# EAGLE design mainboard.pa5 (EAGLE 4.11)
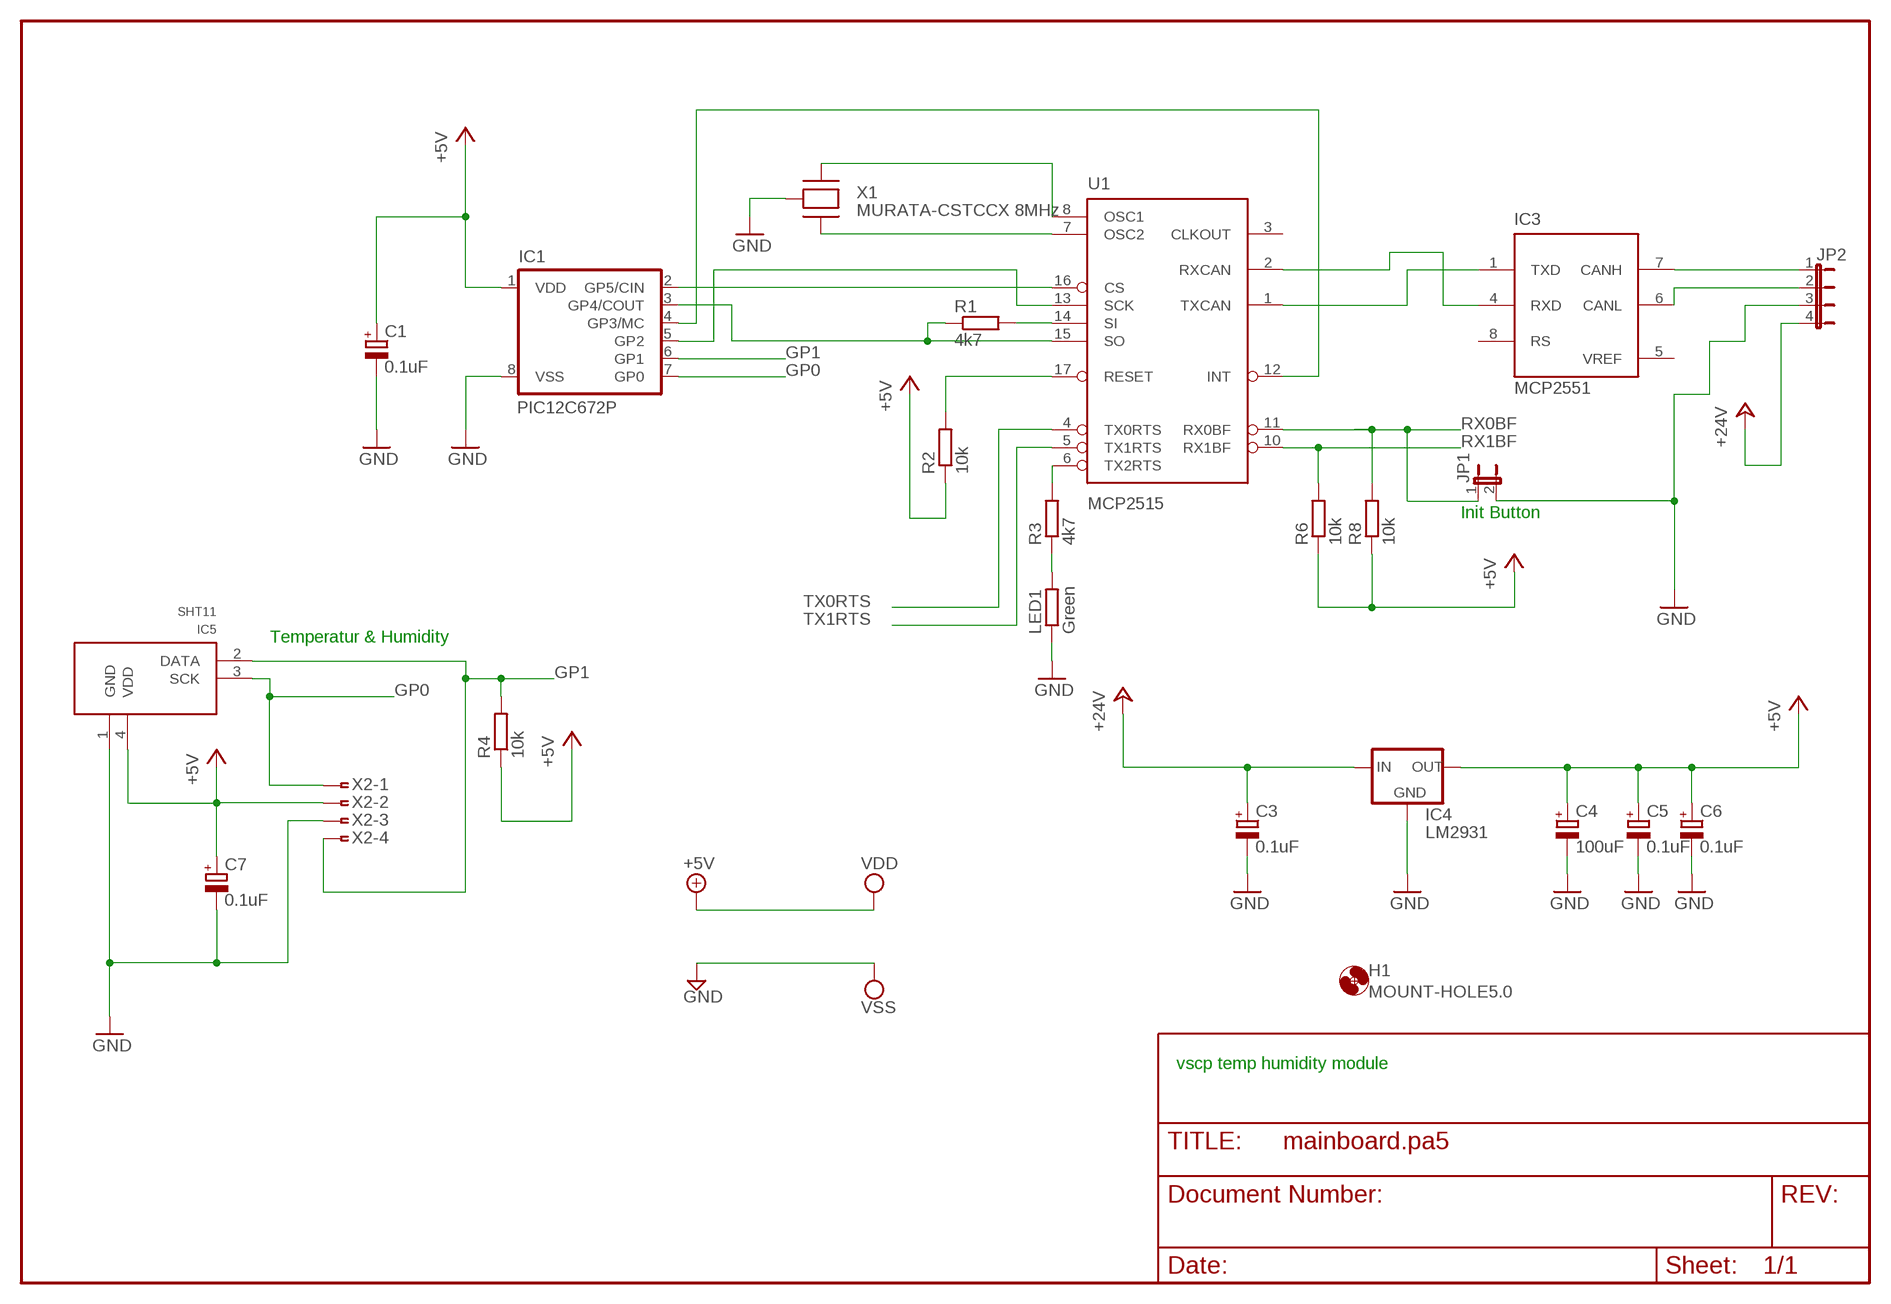
[diagram p0: schematic, sheet 1]

## Parts
C1  0.1uF  CPOL-EUCT3216  [CT3216]
C3  0.1uF  CPOL-EUCT3216  [CT3216]
C4  100uF  CPOL-EUCT7343  [CT7343]
C5  0.1uF  CPOL-EUCT3216  [CT3216]
C6  0.1uF  CPOL-EUCT3216  [CT3216]
C7  0.1uF  CPOL-EUCT3216  [CT3216]
H1  MOUNT-HOLE5.0  [5,0]
IC1  PIC12C672P  [DIL8]
IC3  MCP2551  MCP2551SN  [SO-08]
IC4  LM2931  78LXX  [78LXX]
IC5  SHT11  SHT1X  [SHT1X]
JP1  JP1E  [JP1]
JP2  JP4E  [JP4]
LED1  Green  R-EU_R1206  [R1206]
R1  4k7  R-EU_R0805  [R0805]
R2  10k  R-EU_R0805  [R0805]
R3  4k7  R-EU_R0805  [R0805]
R4  10k  R-EU_R0805  [R0805]
R6  10k  R-EU_R0805  [R0805]
R8  10k  R-EU_R0805  [R0805]
U1  MCP2515  MCP2510SO  [SO-18W]
X1  MURATA-CSTCCX 8MHz  MURATA-CSTCCX  [RESONATOR-MURATA-CSTCCX]
X2  FTOP-4  [FTOP-4]

## Nets
+5V: C1.+ C4.+ C5.+ C6.+ C7.+ IC1.1(VDD) IC4.OUT IC5.4(VDD) R2.1 R4.1 R6.1 R8.1 X2.2
+24V: C3.+ IC4.IN JP2.4
CANH: IC3.7(CANH) JP2.1
CANL: IC3.6(CANL) JP2.2
GND: C1.- C3.- C4.- C5.- C6.- C7.- IC1.8(VSS) IC4.GND IC5.1(GND) JP1.2 JP2.3 LED1.1 X1.3(GND) X2.3
GP0: IC1.7(GP0) IC5.3(SCK) X2.1
GP1: IC1.6(GP1) IC5.2(DATA) R4.2 X2.4
GP2: IC1.5(GP2) U1.13(SCK)
GP3: IC1.4(GP3/MC) U1.12(INT)
GP4: IC1.3(GP4/COUT) R1.1 U1.15(SO)
GP5: IC1.2(GP5/CIN) U1.16(CS)
N$3: R2.2 U1.17(RESET)
N$7: R1.2 U1.14(SI)
N$10: LED1.2 R3.1
OSC1: U1.8(OSC1) X1.2(XTIN)
OSC2: U1.7(OSC2) X1.1(XTOUT)
RX0BF: JP1.1 R8.2 U1.11(RX0BF)
RX1BF: R6.2 U1.10(RX1BF)
RXCAN: IC3.4(RXD) U1.2(RXCAN)
TX0RTS: U1.4(TX0RTS)
TX1RTS: U1.5(TX1RTS)
TX2RTS: R3.2 U1.6(TX2RTS)
TXCAN: IC3.1(TXD) U1.1(TXCAN)
Unconnected: IC3.8(RS) U1.3(CLKOUT)

## Notes on the sheet
- Init Button
- Temperatur & Humidity
- vscp temp humidity module

## Power pins joined to a net without a drawn wire
VDD: IC3.3(VDD) U1.18(VDD)
VREF: IC3.5(VREF)
VSS: IC3.2(VSS) U1.9(VSS)

## Library data of the parts
C1 C3-C7 = rcl:CPOL-EU: POLARIZED CAPACITOR, European symbol
H1 = holes:MOUNT-HOLE: MOUNTING HOLE with drill center marker
IC1 = microchip:PIC12C*?: MICROCONTROLLER
IC3 = microchip_can:MCP2551: High Speed CAN tranceiver
IC4 = v-reg:78LXX: VOLTAGE REGULATOR
IC5 = eurosource_ftdi:SHT1X
JP1 = jumper:JP1E: JUMPER
JP2 = jumper:JP4E: JUMPER
LED1 R1-R4 R6 R8 = rcl:R-EU_: RESISTOR, European symbol
U1 = microchip_can:MCP2510
X1 = eurosource_ftdi:MURATA-CSTCCX
X2 = con-amp:FTOP-4: AMP connector

## Board
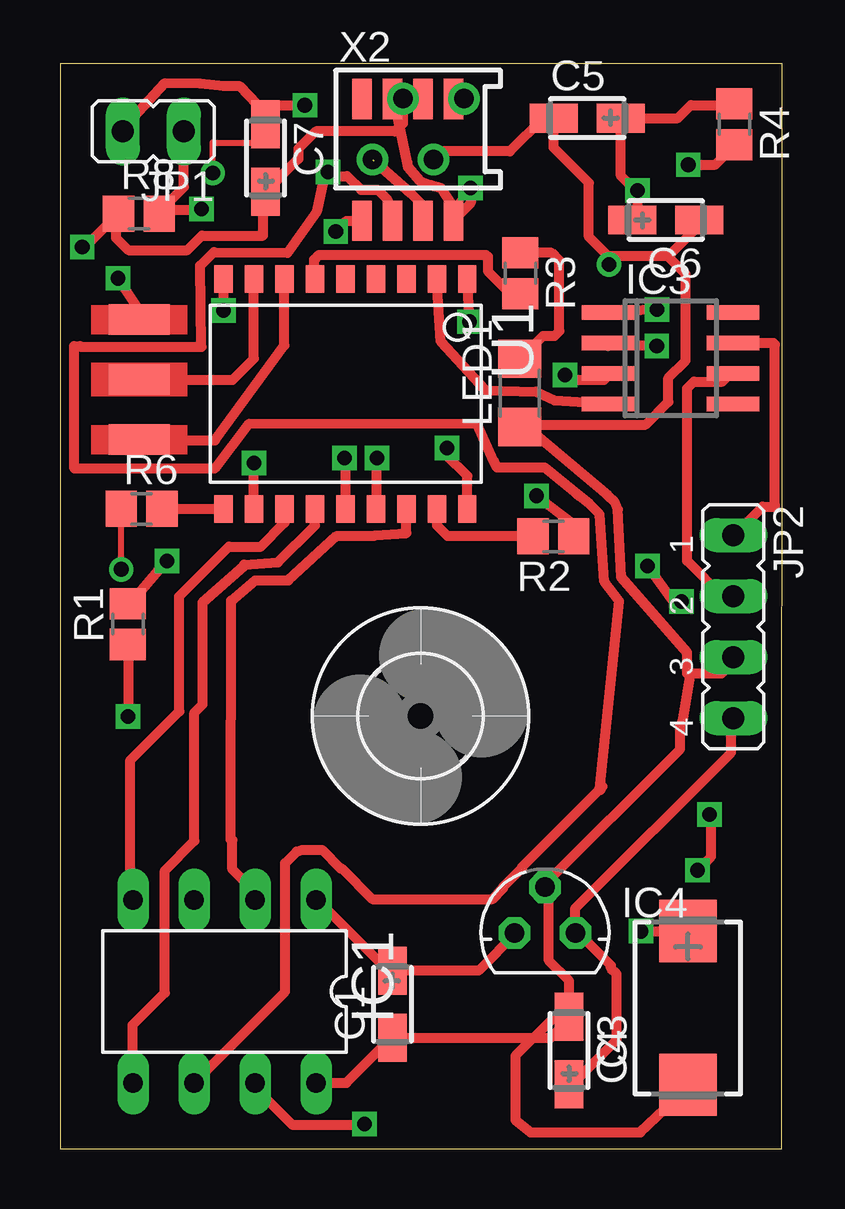
[diagram p1: board, top side]
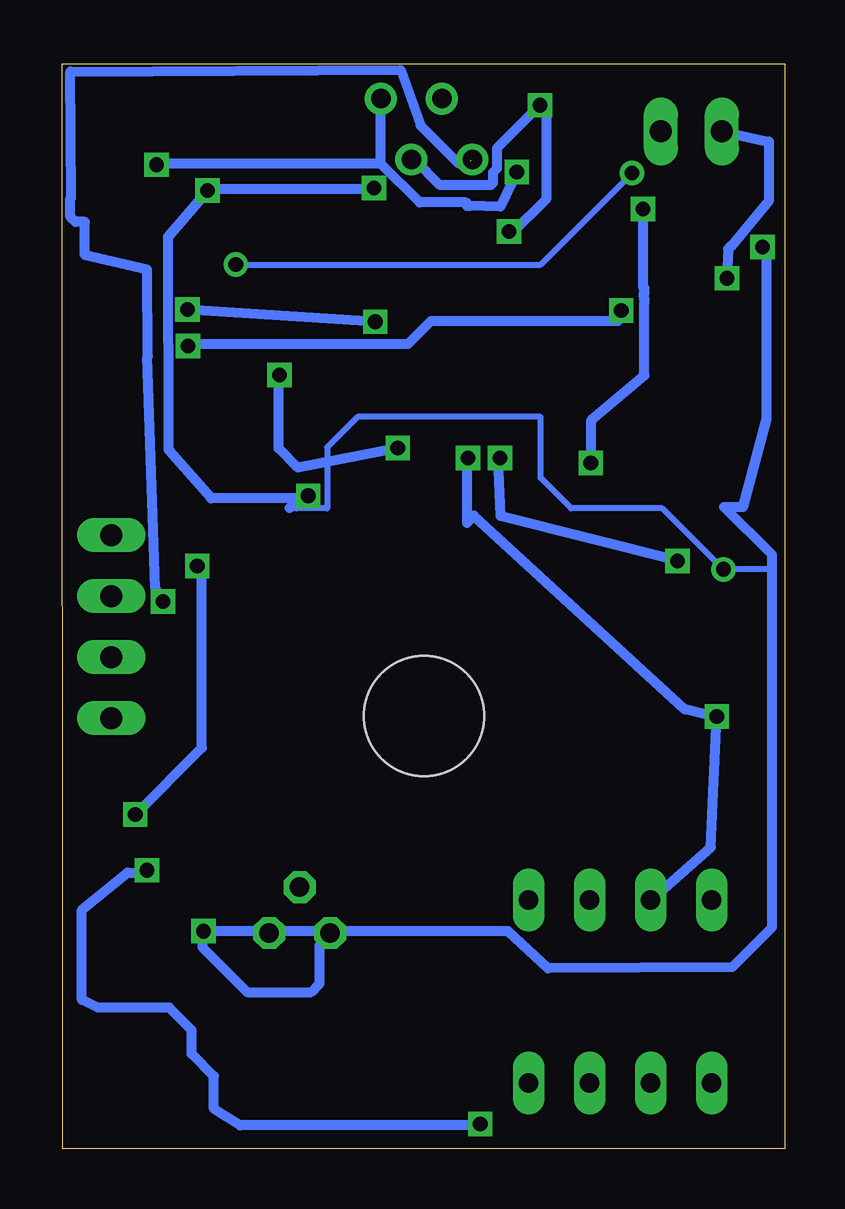
[diagram p2: board, bottom side, seen from below]

Size 30.1 x 45.21 mm. Coordinates in mm from the lower left corner, seen from the top.
Outline: 0.01,0 30.08,0 30.1,45.21 0,45.2 0.01,0
Copper layers (1*16): Top 0.0254mm / dielectric 1.4986mm / Bottom 0.0254mm
Design rules "default": minimum track width 10mil, minimum drill 24mil, track to track 8mil, track to pad 8mil, pad to pad 8mil, via to via 8mil, smd to smd 8mil, copper to edge 40mil, drill to drill 8mil, minimum pad ring 10mil, minimum via ring 8mil, stop-mask expansion 4mil, vias tented up to drill 0mil, thermal gap 10mil

### Footprints (pad centres in the part's own frame; a part is rotated, then mirrored left to right if it is on the bottom)
CT3216 = smd 2 x 1.2: + 1.4,0; - -1.4,0
CT7343 = smd 2.6 x 2.4: + 3.2,0; - -3.2,0
5,0 = hole 5: 0,0
DIL8 = drill 0.813 long: 1 -3.81,-3.81; 2 -1.27,-3.81; 3 1.27,-3.81; 4 3.81,-3.81; 5 3.81,3.81; 6 1.27,3.81; 7 -1.27,3.81; 8 -3.81,3.81
SO-08 = smd 0.6 x 2.2: 1 -1.905,-2.6; 2 -0.635,-2.6; 3 0.635,-2.6; 4 1.905,-2.6; 5 1.905,2.6; 6 0.635,2.6; 7 -0.635,2.6; 8 -1.905,2.6
78LXX = drill 0.813 octagon: GND 0,1.905; IN 1.27,0; OUT -1.27,0
SHT1X = smd 1.676 x 0.813: 1 -2.54,2.54; 2 -2.54,1.27; 3 -2.54,0; 4 -2.54,-1.27; P$5 2.54,2.54; P$6 2.54,1.27; P$7 2.54,0; P$8 2.54,-1.27
JP1 = drill 0.914 long: 1 0,-1.27; 2 0,1.27
JP4 = drill 0.914 long: 1 -3.81,0; 2 -1.27,0; 3 1.27,0; 4 3.81,0
R1206 = smd 1.6 x 1.803: 1 -1.422,0; 2 1.422,0
R0805 = smd 1.3 x 1.5: 1 -0.85,0; 2 0.85,0
SO-18W = smd 0.762 x 1.143: 1 -5.08,-4.788; 2 -3.81,-4.788; 3 -2.54,-4.788; 4 -1.27,-4.788; 5 0,-4.788; 6 1.27,-4.788; 7 2.54,-4.788; 8 3.81,-4.788; 9 5.08,-4.788; 10 5.08,4.788; 11 3.81,4.788; 12 2.54,4.788; 13 1.27,4.788; 14 0,4.788; 15 -1.27,4.788; 16 -2.54,4.788; 17 -3.81,4.788; 18 -5.08,4.788
RESONATOR-MURATA-CSTCCX = smd 2.54 x 1.27: 1 0,2.4; 2 0,-0.1; 3 0,-2.6
FTOP-4 = drill 0.813 round: 1 -1.905,-1.27; 2 -0.635,1.27; 3 0.635,-1.27; 4 1.905,1.27

### Placement (x,y rotation side)
C1  13.85,6.01 90 top
C3  21.21,4.09 270 top
C4  26.16,5.86 90 top
C5  21.97,42.93 0 top
C6  25.24,38.69 180 top
C7  8.56,41.28 270 top
H1  15.02,18.02 0 top
IC1  6.86,6.54 180 top
IC3  25.45,32.93 270 top
IC4  20.21,8.98 0 top
IC5  15.13,41.19 90 top
JP1  3.89,42.38 90 top
JP2  28.06,21.74 270 top
LED1  19.15,31.49 90 top
R1  2.83,21.85 90 top
R2  20.56,25.51 180 top
R3  19.18,36.47 270 top
R4  28.1,42.68 270 top
R6  3.4,26.66 0 top
R8  3.29,38.95 0 top
U1  11.89,31.44 180 top
X1  3.31,31.94 180 top
X2  14.92,42.48 0 top

### Tracks (layer width: path | path; a pad name or v marks a point on that pad's centre or on a via)
+5V  (via drill 0.61)
  Top 0.254: 16.52,39.37 IC5.4 | v17.11,40.02 16.52,39.37 | 16.52,39.37 16.39,39.25 | v2.55,24.13 2.55,26.67 R6.1
  Top 0.406: IC1.1 10.71,10.35 10.72,10.37 13.68,7.41 C1.+ 17.44,7.41 19.01,8.98 | 19.01,8.98 19.07,9.04 | IC4.OUT 19.01,8.98 | C6.+ 24.06,38.69 v24.06,39.92 24.06,39.84 | v17.11,40.02 17.11,39.4 16.4,38.68 | 8.63,40.3 8.46,40.13 8.46,38.04 8.45,38.03 5.91,38.03 5.31,37.43 2.85,37.43 2.33,37.95 2.33,38.92 2.39,38.98 2.41,38.95 R8.1 1.1,37.62 0.99,37.62 v0.93,37.56 | v24.21,9.06 C4.+ | 16.4,39.24 16.39,39.25 15.88,40.02 15.44,40.14 15.01,40.3 14.5,40.88 14.48,41.09 13.93,43.67 14.27,43.69 14.29,43.71 X2.2 14.29,42.71 13.96,42.39 10.67,42.39 9.94,41.66 9.94,41.24 8.58,39.88 C7.+ | R4.1 28.1,43.49 28.1,43.48 26.29,43.48 25.74,42.93 C5.+ 23.37,40.53 24.06,39.84 | v0.93,37.56 | 24.06,39.84 24.1,39.79 | R2.1 21.41,26.02 v19.85,27.2
  Bottom 0.254: 0.53,24.13 v2.55,24.13 5.09,26.67 8.9,26.67 10.17,27.94 10.17,30.48 17.79,30.48 19.06,29.21 19.06,26.67 20.33,26.67 v19.85,27.2
  Bottom 0.406: v17.11,40.02 17.11,39.99 24.07,39.99 24.07,39.92 v24.06,39.92 24.02,39.92 | 23.64,9.06 v24.21,9.06 | 23.64,9.06 24.26,9.14 24.26,8.39 22.4,6.52 19.73,6.52 19.37,6.88 19.37,8.47 18.9,8.95 IC4.OUT | 23.64,9.06 11.52,9.06 9.85,7.5 2.19,7.56 0.53,9.22 0.53,24.13 0.53,24.74 2.53,26.74 1.73,26.74 0.76,30.4 0.76,36.93 | 0.76,36.93 0.7,37.56 v0.93,37.56 | v19.85,27.2 20.64,26.68 20.23,27.09 23.9,27.09 25.66,29.09 25.7,38 24.02,39.92 | 24.02,39.92 23.94,40 | 0.76,36.93 0.76,37.42 0.99,37.65 1.05,37.65 1.21,37.82
+24V
  Top 0.406: C3.+ 21.34,2.69 23.19,4.53 23.19,7.28 22.95,7.51 22.95,7.63 21.56,9.02 21.52,8.98 IC4.IN 21.48,10.01 27.96,16.5 27.96,17.65 28.16,17.85 JP2.4
CANH
  Top 0.406: IC3.7 29.73,33.56 29.79,33.5 29.79,26.79 29.75,26.75 29.27,26.75 28.06,25.53 | 28.06,25.53 27.96,25.44 | JP2.1 28.06,25.53
CANL
  Top 0.406: JP2.2 27.6,23.01 26.13,24.48 26.13,31.67 26.41,31.95 27.6,31.95 27.96,32.31 27.98,32.29 IC3.6
GND  (via drill 0.61)
  Top 0.254: JP2.3 27.95,20.32 27.56,19.79 | 8.56,43.11 8.9,43.18 C7.- 8.9,41.91 6.36,41.91 v6.36,40.64 | 22.87,37.18 v22.87,36.83
  Top 0.406: C6.- 26.75,38.58 25.34,37.18 25.34,37.15 | X2.3 15.56,41.18 15.97,41.54 18.75,41.54 20.14,42.93 C5.- 20.57,41.7 22.03,40.23 22.03,37.98 22.84,37.18 22.87,37.18 25.32,37.18 | 8.56,43.11 7.5,44.26 6.81,44.26 5.84,44.38 4.36,44.38 2.64,42.48 JP1.2 | 13.85,4.66 13.93,4.73 | 13.85,4.66 C1.- 20.45,4.61 21.28,5.45 21.24,5.49 C3.- | IC1.8 11.93,2.73 13.85,4.66 | C3.- 20.61,5.49 18.98,3.86 18.98,1.2 19.61,0.68 24.18,0.68 26.21,2.59 26.16,2.64 C4.- | C3.- 21.21,6.99 20.37,7.83 20.37,10.89 20.25,11.01 20.21,10.97 IC4.GND 20.08,10.89 | 26.13,19.79 26.25,19.67 25.97,17.92 25.84,17.58 25.84,16.65 20.08,10.89 | 28.15,20.47 28.2,20.43 27.56,19.79 26.13,19.79 | 26.13,19.79 26.13,20.67 23.38,23.81 23.25,26.63 23.11,26.94 22.84,27.19 19.33,30.16 | 19.33,30.16 LED1.1 | 25.34,37.15 25.46,37.29 | 25.32,37.18 25.34,37.15 | 20.08,10.89 20,10.81 | X1.3 3.46,34.7 v2.41,36.26 | IC5.1 11.94,38.65 v11.49,38.21 | v10.2,43.47 8.91,43.47 8.68,43.24 8.68,42.47 8.56,42.59 C7.- | 19.33,30.16 24.4,30.16 25.35,31.11 25.35,32.11 26.07,32.83 26.07,36.43 25.32,37.18 | 25.32,37.18 25.31,37.19 | 25.32,37.18
  Bottom 0.254: v6.36,40.64 10.17,36.83 v22.87,36.83
  Bottom 0.406: v2.41,36.26 2.36,37.49 2.27,37.58 2.24,37.58 0.66,39.49 0.66,41.95 2.64,42.38 | 2.64,42.38 2.65,42.38 | JP1.2 2.64,42.38 | v11.49,38.21 11.43,38.15 11.35,38.15 9.94,39.55 9.94,43.21 v10.2,43.47 | X2.3 15.42,41.21 14.36,40.15 12.25,40.15 12.16,40.23 12.16,40.66 12,40.83 12,41.67 v10.2,43.47 | v10.2,43.47 10.14,43.52
GP0  (via drill 0.61)  (1 unrouted)
  Top 0.406: 13.02,41.19 13.01,41.18 | 13.02,41.19 X2.1 | 15.13,39.1 IC5.3 15.13,38.7 15.07,38.76 15.07,39.36 14.63,39.79 13.06,41.19 13.02,41.19 | v25.9,22.79 25.9,22.76 25.84,22.69 25.6,22.69 v24.48,24.27 | v27.06,13.91 27.13,13.85 27.13,12.16 v26.56,11.6 | 12.73,0.78 12.63,0.77 v12.68,1.03 12.68,0.99 12.68,0.98 12.67,0.99 9.67,0.99 8.13,2.53 IC1.7
  Bottom 0.406: 13.09,41.14 13.41,41.04 13.58,41.04 15.17,42.63 16,44.95 29.77,44.88 29.73,39.6 29.77,39.56 29.76,38.81 29.75,38.81 29.55,38.61 29.16,38.61 29.16,37.22 26.57,36.62 26.53,33.02 26.56,32.99 26.23,23.36 v25.9,22.79 | v24.48,24.27 24.28,24.05 24.28,16.7 v27.06,13.91 | v26.56,11.6 26.56,11.56 26.5,11.5 27.39,11.5 29.28,9.94 29.28,6.2 28.62,5.87 25.64,5.87 24.71,4.94 24.71,3.95 23.78,3.02 23.78,1.66 22.69,0.97 12.86,0.97 v12.68,1.03
GP1  (via drill 0.61)
  Top 0.406: 13.86,38.63 13.9,38.59 | 13.86,38.63 IC5.2 | 13.86,38.63 13.65,38.84 13.65,39.53 13.24,39.94 12.55,39.94 11.97,40.52 11.36,40.52 11.19,40.68 v11.16,40.68 11.16,40.72 | 0.84,33.41 0.79,33.41 | 0.84,33.41 5.89,33.41 5.84,36.79 6.41,37.36 9.49,37.32 10.72,39.06 11.06,40.61 11.16,40.72 | IC1.6 5.59,2.75 9.38,6.54 9.38,11.89 9.86,12.37 10.11,12.44 10.92,12.44 11.68,11.68 11.73,11.68 13.02,10.39 18.01,10.39 18.46,10.84 18.46,10.89 19.25,11.68 19.25,11.73 22.49,14.97 | 11.16,40.72 11.23,40.78 | R4.2 28.1,41.79 28.11,41.79 27.31,40.99 v26.18,40.99 | 22.49,14.97 22.61,15.09 | 22.49,14.97 | 22.49,14.97 23.3,22.81 22.69,23.62 22.49,26.42 22.08,26.84 21.53,27.28 21.66,27.17 20.19,28.38 18.21,28.38 18.07,28.64 17.38,30.18 7.87,30.2 6.44,28.33 0.6,28.33 0.59,33.43 0.84,33.43 | 22.49,14.97 22.51,14.94 | 0.84,33.43 | 0.84,33.43 0.84,33.41
  Bottom 0.406: 13.14,39.27 11.84,39.24 v11.16,40.68 | 13.14,39.27 13.25,39.28 | 16.83,41.04 X2.4 | 16.83,41.04 15.21,39.42 13.29,39.42 13.14,39.27 | 13.14,39.27 | 13.14,39.27 | 16.83,41.04 26.13,41.04 v26.18,40.99
GP2
  Top 0.406: U1.13 10.62,25.95 9.08,24.42 7.67,24.33 7.67,24.29 7.67,24.28 5.95,22.76 5.95,18.5 5.6,18.16 5.6,12.82 4.37,11.58 4.37,6.48 3.03,5.15 3.03,2.82 3.12,2.73 | 3.12,2.73 3.18,2.68 | IC1.5 3.12,2.73
GP3
  Top 0.406: 3.03,10.22 3.05,10.23 IC1.4 2.92,10.35 2.88,10.39 2.93,10.44 2.93,16.18 4.97,18.22 4.97,23 4.96,23.01 7.04,25.08 8.37,25.08 9.35,26.07 U1.12
GP4  (via drill 0.61)
  Top 0.406: v2.83,18.01 2.87,18.01 2.87,21.03 R1.1 | v13.2,28.77 U1.15
  Bottom 0.406: IC1.3 3.07,12.56 v2.83,18.01 2.83,17.97 4.16,18.3 12.95,26.37 13.23,26.07 13.23,28.74 13.26,28.77 | 13.24,28.81 v13.2,28.77 13.26,28.77 | 13.26,28.77 13.26,28.78
GP5
  Top 0.406: U1.16 14.43,25.66 14.41,25.63 13.13,25.55 13.07,25.53 11.54,25.53 9.51,23.68 8.13,23.68 7.14,22.83 7.11,12.89 7.18,12.87 7.18,11.63 8.32,10.49 8.19,10.35 IC1.2
N$3
  Top 0.406: U1.17 15.7,25.96 16.14,25.53 19.55,25.53 19.6,25.58 19.67,25.51 R2.2
N$7  (via drill 0.61)
  Top 0.406: U1.14 v11.86,28.78 | v4.46,24.48 4.46,24.52 2.83,22.57 R1.2
  Bottom 0.406: v11.86,28.78 11.93,28.73 11.84,26.35 v4.46,24.48
N$10
  Top 0.406: R3.1 20.48,37.32 20.8,37 20.8,34.06 20.61,33.86 20.13,33.86 19.15,32.89 | 19.15,32.89 19.1,32.83 | LED1.2 19.15,32.89
OSC1
  Top 0.406: U1.8 8.08,32.91 7.2,32.02 3.48,32.02 3.46,32.01 | 3.46,32.01 3.39,31.94 | X1.2 3.46,32.01
OSC2
  Top 0.406: 3.44,29.54 3.39,29.59 | 3.44,29.54 X1.1 3.39,29.54 | 3.44,29.54 3.45,29.54 | U1.7 9.35,33.47 6.45,29.51 3.42,29.51 3.39,29.54 | 3.39,29.54 3.36,29.56
RX0BF  (via drill 0.61)
  Top 0.406: JP1.1 5.16,40.06 4.07,38.98 4.1,38.95 R8.2 4.28,39.09 5.79,39.09 5.82,39.12 v5.9,39.15 | U1.11 v8.08,28.56
  Bottom 0.406: v8.08,28.56 8.08,28.65 8.05,28.68 8.05,30.36 5.85,32.22 5.85,35.26 5.84,35.26 5.84,35.39 5.83,35.36 | 5.76,39.09 v5.9,39.15 5.9,35.89 5.85,35.86 5.85,35.83 | 5.85,35.83 5.85,35.8 | 5.83,35.36 5.84,35.37 | 5.85,35.83 5.84,35.64 5.87,35.61 5.88,35.56 5.83,35.36
RX1BF
  Top 0.406: U1.10 6.87,26.6 | U1.10 | R6.2 U1.10
RXCAN
  Top 0.406: IC3.4 20.61,31.17 19.84,31.53 17.72,31.6 15.87,33.62 15.71,36.17 U1.2
TX2RTS
  Top 0.406: R3.2 18.77,35.62 17.82,36.56 17.82,37.16 17.74,37.24 10.79,37.24 10.59,37.04 10.59,36.2 U1.6
TXCAN  (via drill 0.61)
  Top 0.406: v17.06,34.45 U1.1 | v24.88,34.96 24.99,34.96 22.76,34.88 IC3.1
  Bottom 0.406: v17.06,34.45 17.1,34.45 v24.88,34.96
VDD  (via drill 0.61)
  Top 0.406: v21.04,32.23 21.08,32.23 21.28,32.03 22.67,32.03 22.85,32.2 IC3.3 | v16.12,29.19 16.12,28.87 16.97,28.02 16.97,26.71 16.99,26.69 16.97,26.67 U1.18
  Bottom 0.406: v16.12,29.19 20.29,28.38 21.08,29.17 21.08,32.19 v21.04,32.23
VSS  (via drill 0.61)
  Top 0.406: U1.9 v6.81,34.93 v6.81,34.92 | 24.9,33.45 v24.86,33.45 22.84,33.45 22.81,33.48 22.85,33.52 IC3.2
  Bottom 0.406: v6.81,34.92 6.81,34.61 6.95,34.48 14.74,34.48 15.7,33.51 24.8,33.51 v24.86,33.45